# Altium schematic sheet CONNECTOR.SchDoc
size A4; SheetNumber: 4; SheetTotal: 4
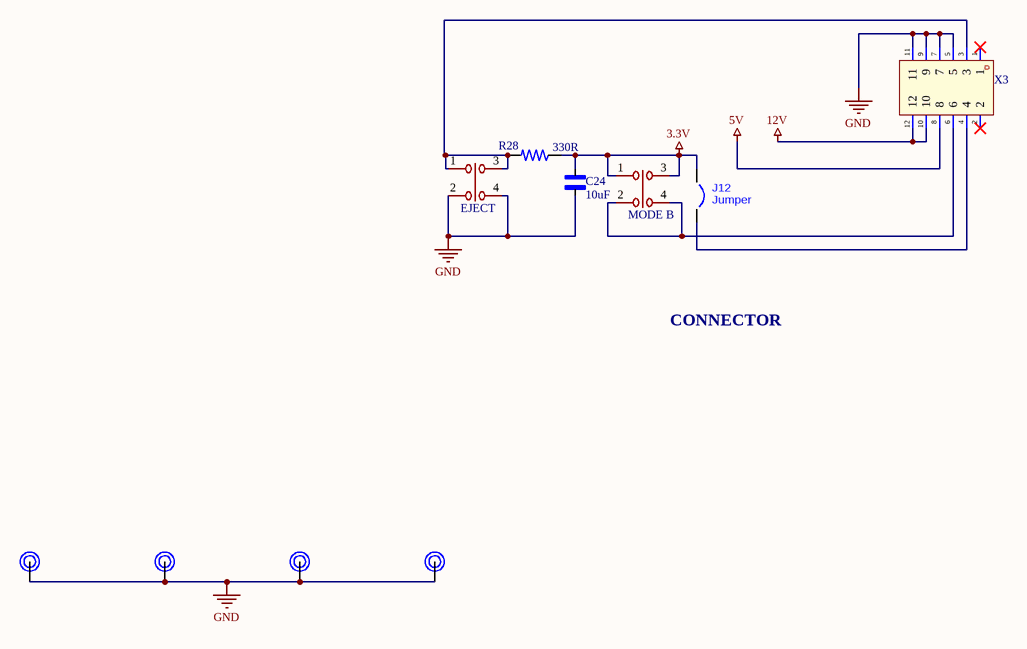
[diagram p0: CONNECTOR.SchDoc]

## Parts
C24  value 10uF  [CAP_0805]  (hidden comment: SMD capacitor)
EJECT  THT Button  [SW-TH_BTSA-X-P-11]  (value not drawn)
J12  Jumper  [PAD-JUMPER-2-NC_BY_PASTE_YES_SILK]
MODE_B  THT Button  [SW-TH_BTSA-X-P-11]  (value not drawn)
R28  value 330R  [RES_0603]  (hidden comment: SMD resistor)
SCREW_1  Screw Hole  [PCB hole]  (value not drawn)
SCREW_2  Screw Hole  [PCB hole]  (value not drawn)
SCREW_3  Screw Hole  [PCB hole]  (value not drawn)
SCREW_4  Screw Hole  [PCB hole]  (value not drawn)
X3  Connector  [CONN-TH_S12B-PHDSS-B-LF-SN]  (value not drawn)

## Nets
3.3V: C24.1 J12.1 MODE_B.1 MODE_B.3 R28.1
5V: X3.8
12V: X3.10 X3.12
GND: C24.2 EJECT.2 EJECT.4 SCREW_1.1 SCREW_2.1 SCREW_3.1 SCREW_4.1 X3.5 X3.7 X3.9 X3.11
NetEJECT_1: EJECT.1 EJECT.3 R28.2 X3.3
NetJ12_2: J12.2 X3.4
NetMODE_B_2: MODE_B.2 MODE_B.4 X3.6

Not connected (* = marked no-connect by the designer): X3 1* 2*

## Notes on the sheet
- CONNECTOR

## Library data of the parts
C24 = CAP_SMD_CERAMIC: Voltage: 50V; Tolerance: ±10%; Package: 0805; Price: *; JLCPCB Part #: *
EJECT MODE_B = BTSA-L-P-11: Latching Through Hole 10,000 Cycles Without 2.5N 50mA Through Hole Pushbutton Switches ROHS; Manifacturing Company Name: ROCPU Switches; Manifacturing Part Number: BTSA-L-P-11; Data Sheet: https://www.lcsc.com/datasheet/C2693635.pdf; Package: THT; Price: N/A; Tolerance: N/A; JLCPCB Part #: C2693635; Value: N/A
J12 = JUMPER SOLDER BRIDGE: SMD JUMPER
R28 = RES_SMD_CERAMIC: Tolerance: ±5%; Package: 0603; Price: *; JLCPCB Part #: *
X3 = S12B-PHDSS-B(LF)(SN): 2x6P 12P PHD Tin 2mm 6 -25℃~+85℃ 3A 2 2mm Copper Alloy Right Angle Through Hole,Right Angle,P=2mm Wire To Board Connector ROHS; Manifacturing Company Name: JST; Tolerance: ±5%; Manifacturing Part Number: S12B-PHDSS-B(LF)(SN); Data Sheet: https://www.lcsc.com/datasheet/C493114.pdf; Package: Through Hole,Right Angle,P=2mm; Price: *; JLCPCB Part #: C493114